# Altium schematic sheet TouchController.SchDoc
size Tabloid; CompanyName: Ploopy Corporation; Organization: Ploopy Corporation; Address1: 137-1140 Burnhamthorpe Road W; Address2: Mississauga; Address3: Ontario; Address4: Canada L5C 0A3; DocumentNumber: 8; Revision: R2.002; SheetNumber: 8; SheetTotal: 8
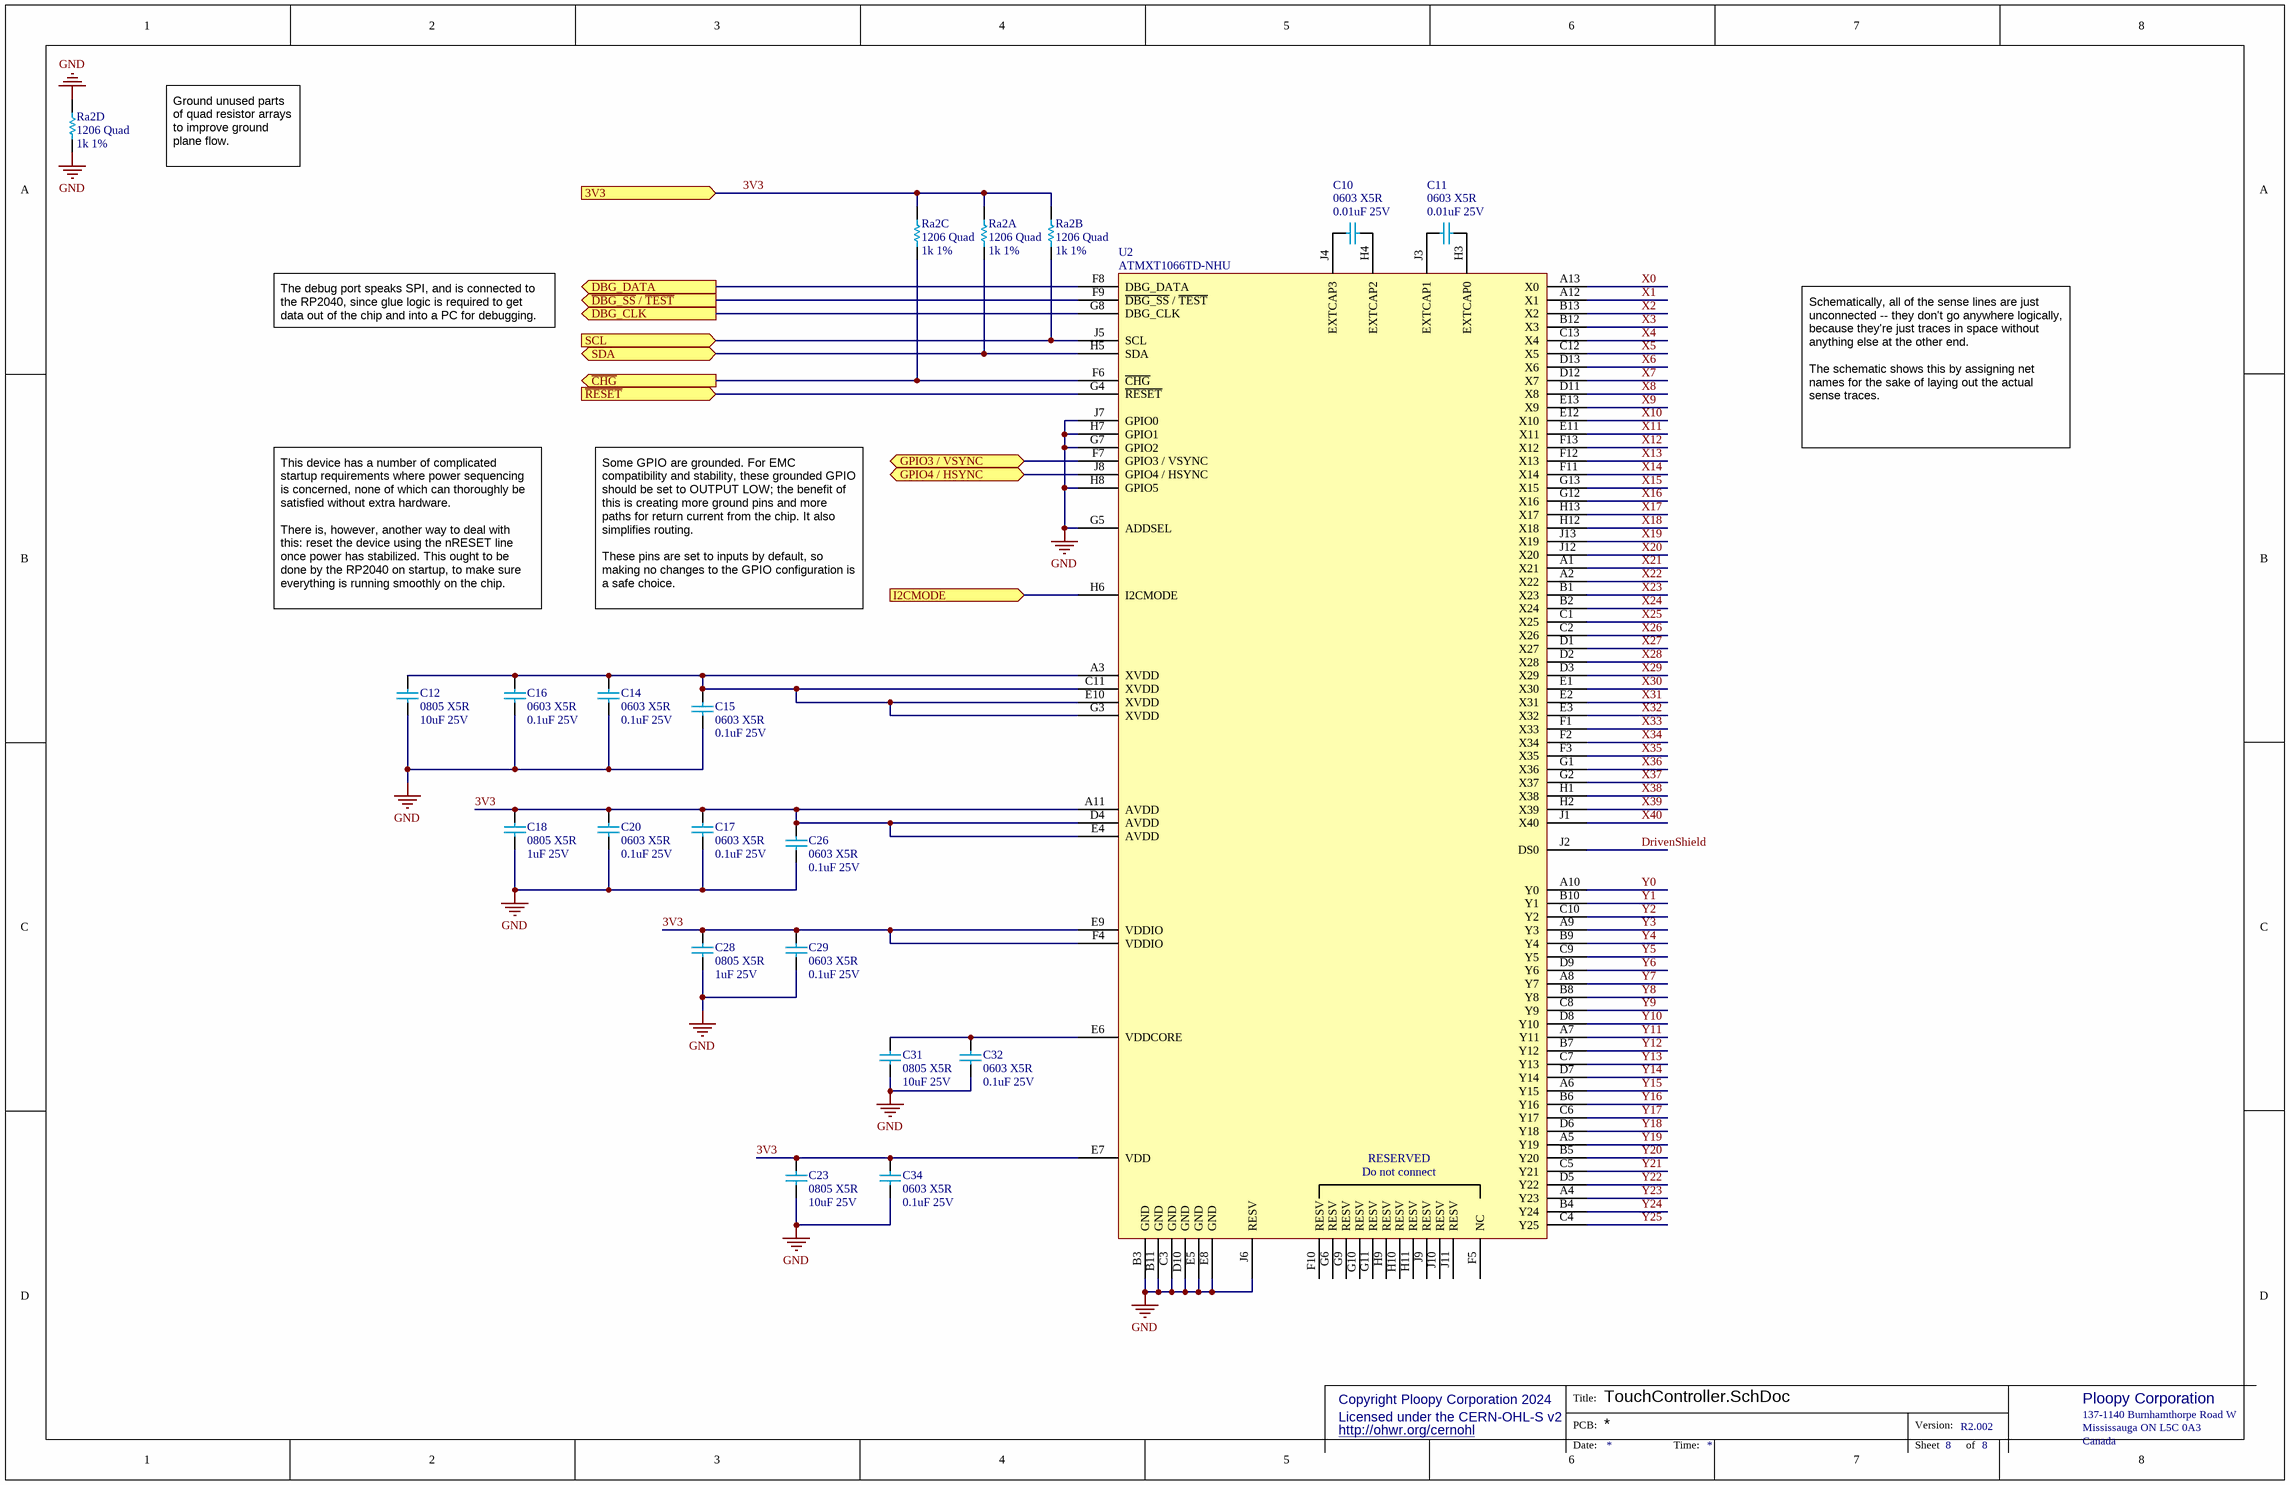
[diagram p0: TouchController.SchDoc]

## Parts
C10  0603 X5R  value 0.01uF 25V  [0603 capacitor - CAPC1608X06N]
C11  0603 X5R  value 0.01uF 25V  [0603 capacitor - CAPC1608X06N]
C12  0805 X5R  value 10uF 25V  [0805 - TALL]
C14  0603 X5R  value 0.1uF 25V  [0603 capacitor - CAPC1608X06N]
C15  0603 X5R  value 0.1uF 25V  [0603 capacitor - CAPC1608X06N]
C16  0603 X5R  value 0.1uF 25V  [0603 capacitor - CAPC1608X06N]
C17  0603 X5R  value 0.1uF 25V  [0603 capacitor - CAPC1608X06N]
C18  0805 X5R  value 1uF 25V  [0805 - TALL]
C20  0603 X5R  value 0.1uF 25V  [0603 capacitor - CAPC1608X06N]
C23  0805 X5R  value 10uF 25V  [0805 - TALL]
C26  0603 X5R  value 0.1uF 25V  [0603 capacitor - CAPC1608X06N]
C28  0805 X5R  value 1uF 25V  [0805 - TALL]
C29  0603 X5R  value 0.1uF 25V  [0603 capacitor - CAPC1608X06N]
C31  0805 X5R  value 10uF 25V  [0805 - TALL]
C32  0603 X5R  value 0.1uF 25V  [0603 capacitor - CAPC1608X06N]
C34  0603 X5R  value 0.1uF 25V  [0603 capacitor - CAPC1608X06N]
Ra2  1206 Quad  value 1k 1%  [4x 1k 1% - CAC-80P320X160-8M]  (parts A,B,C,D of 4)
U2  ATMXT1066TD-NHU  [ATMXT1066TD-NHU - BGA117C65P13X9_950X700X65]

## Ports
3V3 (in), DBG_CLK (out), DBG_DATA (out), GPIO3 / VSYNC (bidir), GPIO4 / HSYNC (bidir), I2CMODE (in), SCL (in), SDA (bidir), ~{CHG} (out), ~{DBG_SS} / ~{TEST} (out), ~{RESET} (in)

## Nets
GND: C12.1 C14.1 C15.1 C16.1 C17.1 C18.1 C20.1 C23.1 C26.1 C28.1 C29.1 C31.1 C32.1 C34.1 Ra2.4 Ra2.5 U2.B3(GND) U2.B11(GND) U2.C3(GND) U2.D10(GND) U2.E5(GND) U2.E8(GND) U2.G5(ADDSEL) U2.G7(GPIO2) U2.H7(GPIO1) U2.H8(GPIO5) U2.J6(RESV) U2.J7(GPIO0)
3V3: C17.2 C18.2 C20.2 C23.2 C26.2 C28.2 C29.2 C34.2 Ra2.6 Ra2.7 Ra2.8 U2.A11(AVDD) U2.D4(AVDD) U2.E4(AVDD) U2.E7(VDD) U2.E9(VDDIO) U2.F4(VDDIO) ; port 3V3
~{CHG}: Ra2.3 U2.F6(~{CHG}) ; port ~{CHG}
~{DBG_SS} / ~{TEST}: U2.F9(~{DBG_SS}_/_~{TEST}) ; port ~{DBG_SS} / ~{TEST}
DBG_CLK: U2.G8(DBG_CLK) ; port DBG_CLK
DBG_DATA: U2.F8(DBG_DATA) ; port DBG_DATA
DrivenShield: U2.J2(DS0)
GPIO3 / VSYNC: U2.F7(GPIO3_/_VSYNC) ; port GPIO3 / VSYNC
GPIO4 / HSYNC: U2.J8(GPIO4_/_HSYNC) ; port GPIO4 / HSYNC
I2CMODE: U2.H6(I2CMODE) ; port I2CMODE
~{RESET}: U2.G4(~{RESET}) ; port ~{RESET}
SCL: Ra2.2 U2.J5(SCL) ; port SCL
SDA: Ra2.1 U2.H5(SDA) ; port SDA
X0: U2.A13(X0)
X1: U2.A12(X1)
X2: U2.B13(X2)
X3: U2.B12(X3)
X4: U2.C13(X4)
X5: U2.C12(X5)
X6: U2.D13(X6)
X7: U2.D12(X7)
X8: U2.D11(X8)
X9: U2.E13(X9)
X10: U2.E12(X10)
X11: U2.E11(X11)
X12: U2.F13(X12)
X13: U2.F12(X13)
X14: U2.F11(X14)
X15: U2.G13(X15)
X16: U2.G12(X16)
X17: U2.H13(X17)
X18: U2.H12(X18)
X19: U2.J13(X19)
X20: U2.J12(X20)
X21: U2.A1(X21)
X22: U2.A2(X22)
X23: U2.B1(X23)
X24: U2.B2(X24)
X25: U2.C1(X25)
X26: U2.C2(X26)
X27: U2.D1(X27)
X28: U2.D2(X28)
X29: U2.D3(X29)
X30: U2.E1(X30)
X31: U2.E2(X31)
X32: U2.E3(X32)
X33: U2.F1(X33)
X34: U2.F2(X34)
X35: U2.F3(X35)
X36: U2.G1(X36)
X37: U2.G2(X37)
X38: U2.H1(X38)
X39: U2.H2(X39)
X40: U2.J1(X40)
Y0: U2.A10(Y0)
Y1: U2.B10(Y1)
Y2: U2.C10(Y2)
Y3: U2.A9(Y3)
Y4: U2.B9(Y4)
Y5: U2.C9(Y5)
Y6: U2.D9(Y6)
Y7: U2.A8(Y7)
Y8: U2.B8(Y8)
Y9: U2.C8(Y9)
Y10: U2.D8(Y10)
Y11: U2.A7(Y11)
Y12: U2.B7(Y12)
Y13: U2.C7(Y13)
Y14: U2.D7(Y14)
Y15: U2.A6(Y15)
Y16: U2.B6(Y16)
Y17: U2.C6(Y17)
Y18: U2.D6(Y18)
Y19: U2.A5(Y19)
Y20: U2.B5(Y20)
Y21: U2.C5(Y21)
Y22: U2.D5(Y22)
Y23: U2.A4(Y23)
Y24: U2.B4(Y24)
Y25: U2.C4(Y25)
NetC10_1: C10.1 U2.J4(EXTCAP3)
NetC10_2: C10.2 U2.H4(EXTCAP2)
NetC11_1: C11.1 U2.H3(EXTCAP0)
NetC11_2: C11.2 U2.J3(EXTCAP1)
NetC12_2: C12.2 C14.2 C15.2 C16.2 U2.A3(XVDD) U2.C11(XVDD) U2.E10(XVDD) U2.G3(XVDD)
NetC31_2: C31.2 C32.2 U2.E6(VDDCORE)

Not connected (* = marked no-connect by the designer): U2 F5(NC) F10(RESV) G6(RESV) G9(RESV) G10(RESV) G11(RESV) H9(RESV) H10(RESV) H11(RESV) J9(RESV) J10(RESV) J11(RESV)

## Notes on the sheet
- Ground unused parts of quad resistor arrays to improve ground plane flow.
- The debug port speaks SPI, and is connected to the RP2040, since glue logic is required to get data out of the chip and into a PC for debugging.
- Schematically, all of the sense lines are just unconnected -- they don't go anywhere logically, because they're just traces in space without anything else at the other end.
  The schematic shows this by assigning net names for the sake of laying out the actual sense traces.
- This device has a number of complicated startup requirements where power sequencing is concerned, none of which can thoroughly be satisfied without extra hardware.
  There is, however, another way to deal with this: reset the device using the nRESET line once power has stabilized. This ought to be done by the RP2040 on startup, to make sure everything is running smoothly on the chip.
- Some GPIO are grounded. For EMC compatibility and stability, these grounded GPIO should be set to OUTPUT LOW; the benefit of this is creating more ground pins and more paths for return current from the chip. It also simplifies routing.
  These pins are set to inputs by default, so making no changes to the GPIO configuration is a safe choice.
- Copyright Ploopy Corporation 2024
- Licensed under the CERN-OHL-S v2
- http://ohwr.org/cernohl
- Title:
- PCB:
- Version:
- Ploopy Corporation
- Mississauga ON L5C 0A3
- 137-1140 Burnhamthorpe Road W
- Date:
- Time:
- Sheet
- of
- Canada
- (in symbol ATMXT1066TD-NHU) RESERVED; Do not connect

## Library data of the parts
C10 C11 = Cap 0.01uF 25V: 0603, X5R or better; Supplier 1: Digi-Key; Supplier Part Number 1: 1276-6840-2-ND
C12 C23 C31 = Cap 10uF 25V: 0805, X5R or better; Supplier 1: Mouser; Supplier Part Number 1: 81-GRM21BR61E106KA3L; Supplier 2: Digi-Key; Supplier Part Number 2: 490-5523-1-ND
C14-C17 C20 C26 C29 C32 C34 = Cap 0.1uF 25V: 0603, X5R or better; Supplier 1: Digi-Key; Supplier Part Number 1: 1276-6840-2-ND
C18 C28 = Cap 1uF 25V: 0805, X5R or better; Supplier 1: Digi-Key; Supplier Part Number 1: 1276-1066-2-ND; Supplier 2: Digi-Key; Supplier Part Number 2: 1276-1066-1-ND
Ra2 = Quad Res 1k 1% 1206: Chip resistor
U2 = ATMXT1066TD-NHU: maXTouch 1066-node Touchscreen Controller